# EAGLE design ballanced_detector (EAGLE 9.6.2)
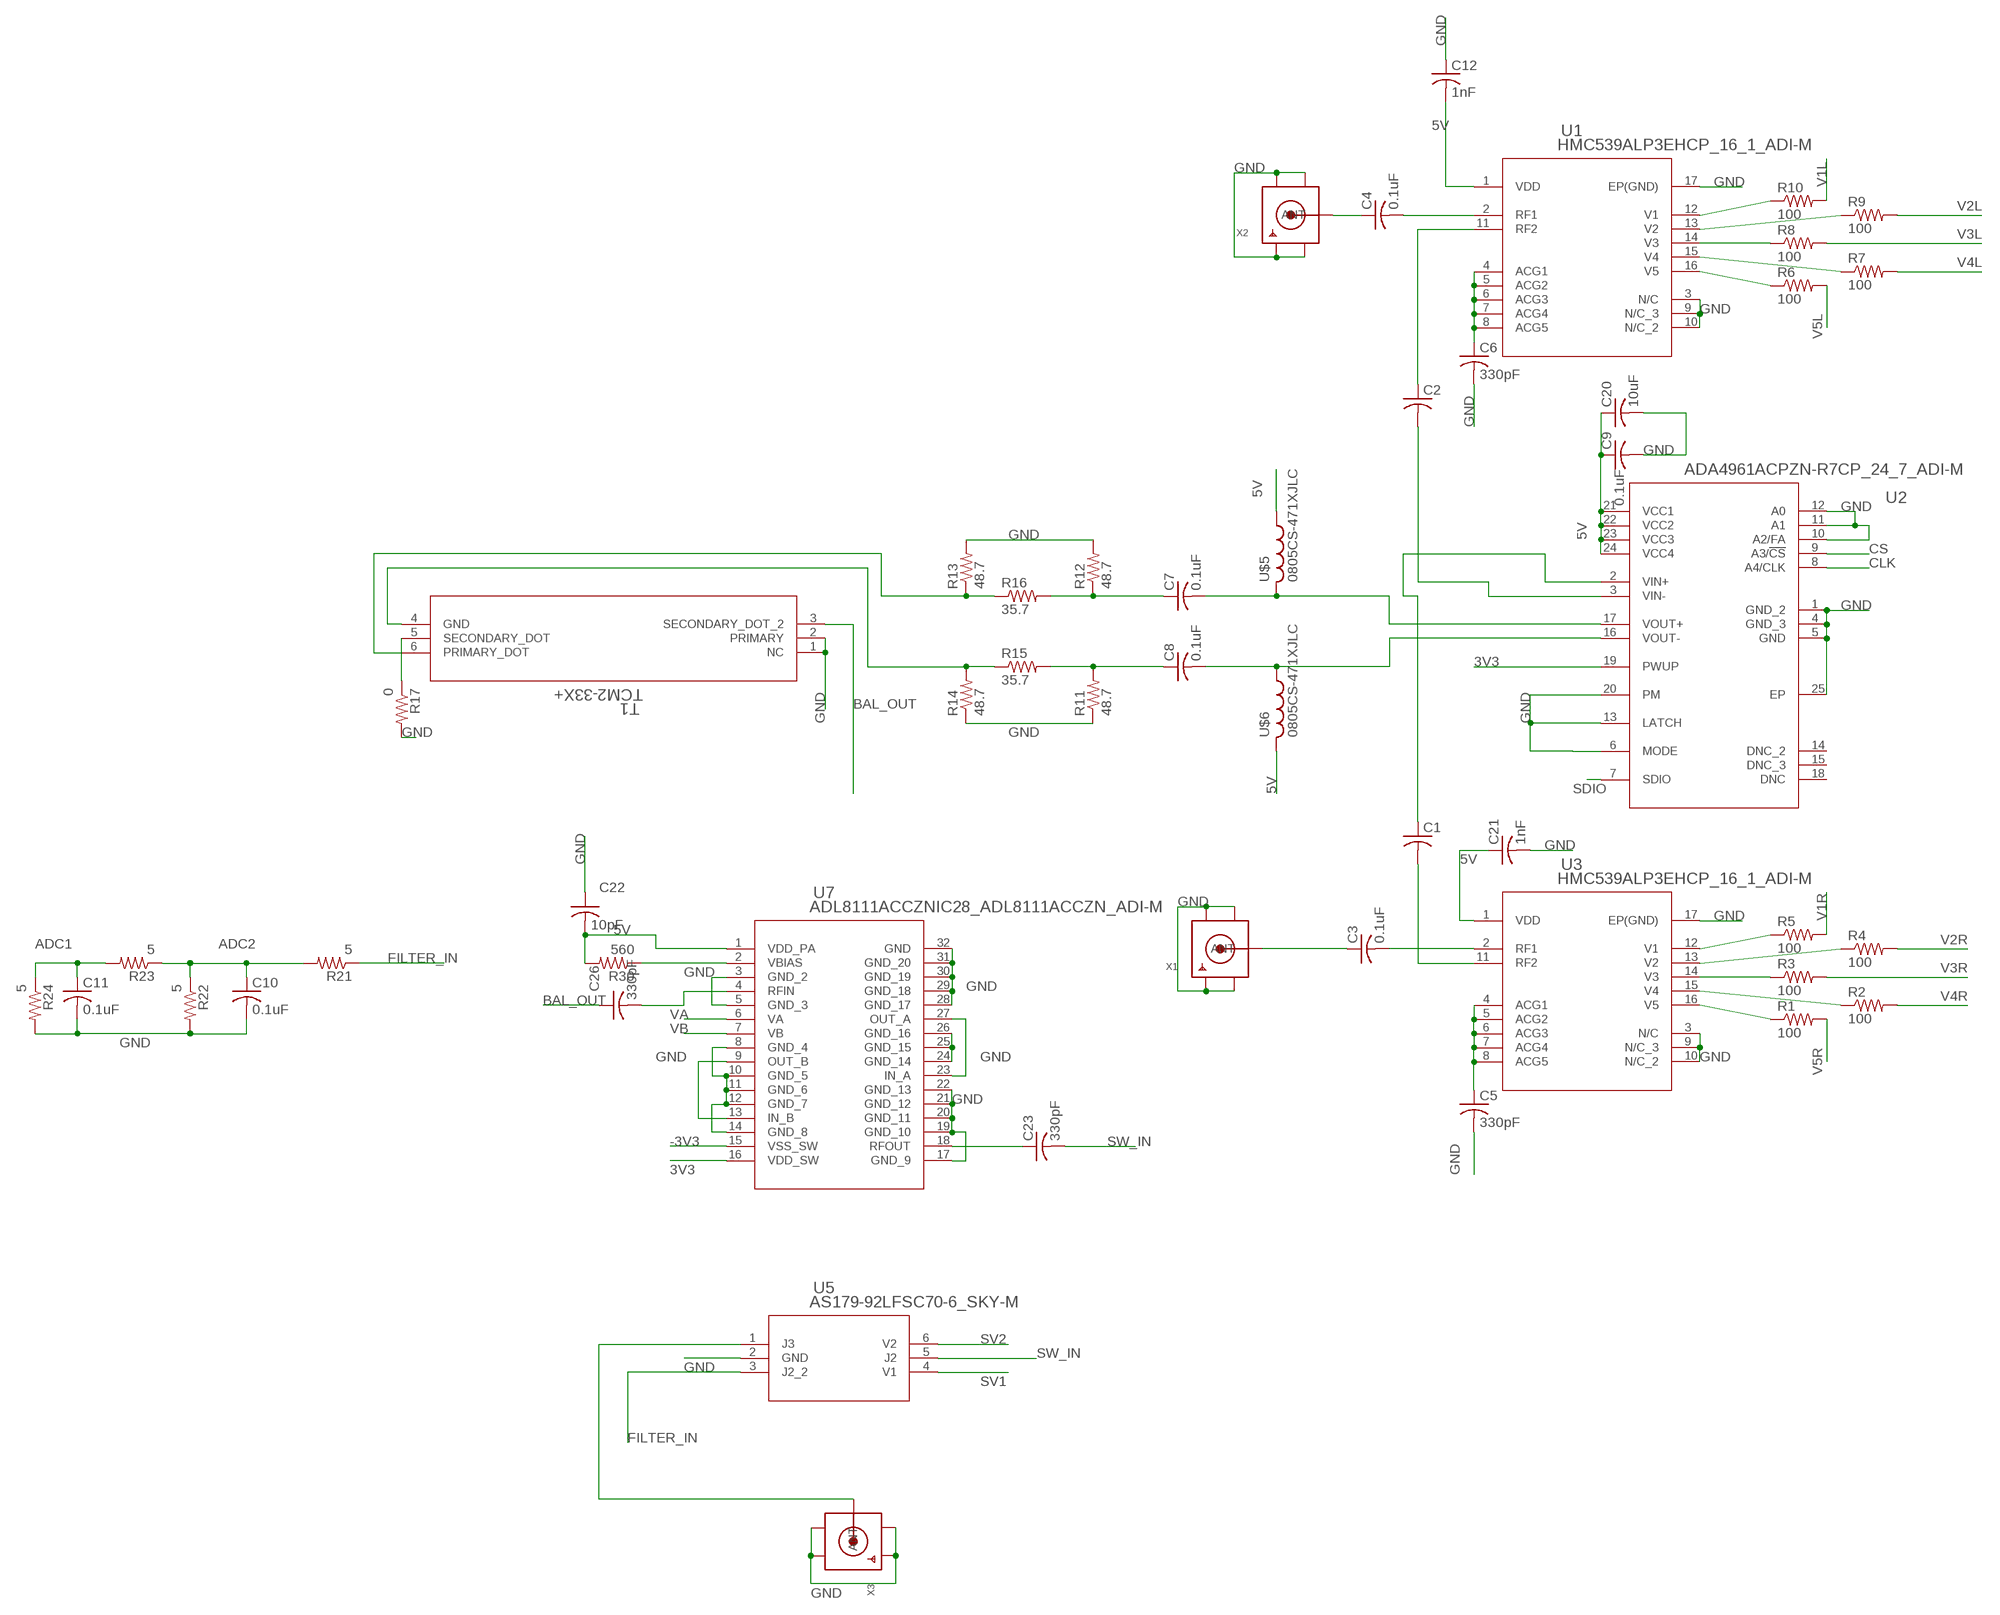
[diagram p0: schematic, sheet 1, part 1 of 2]
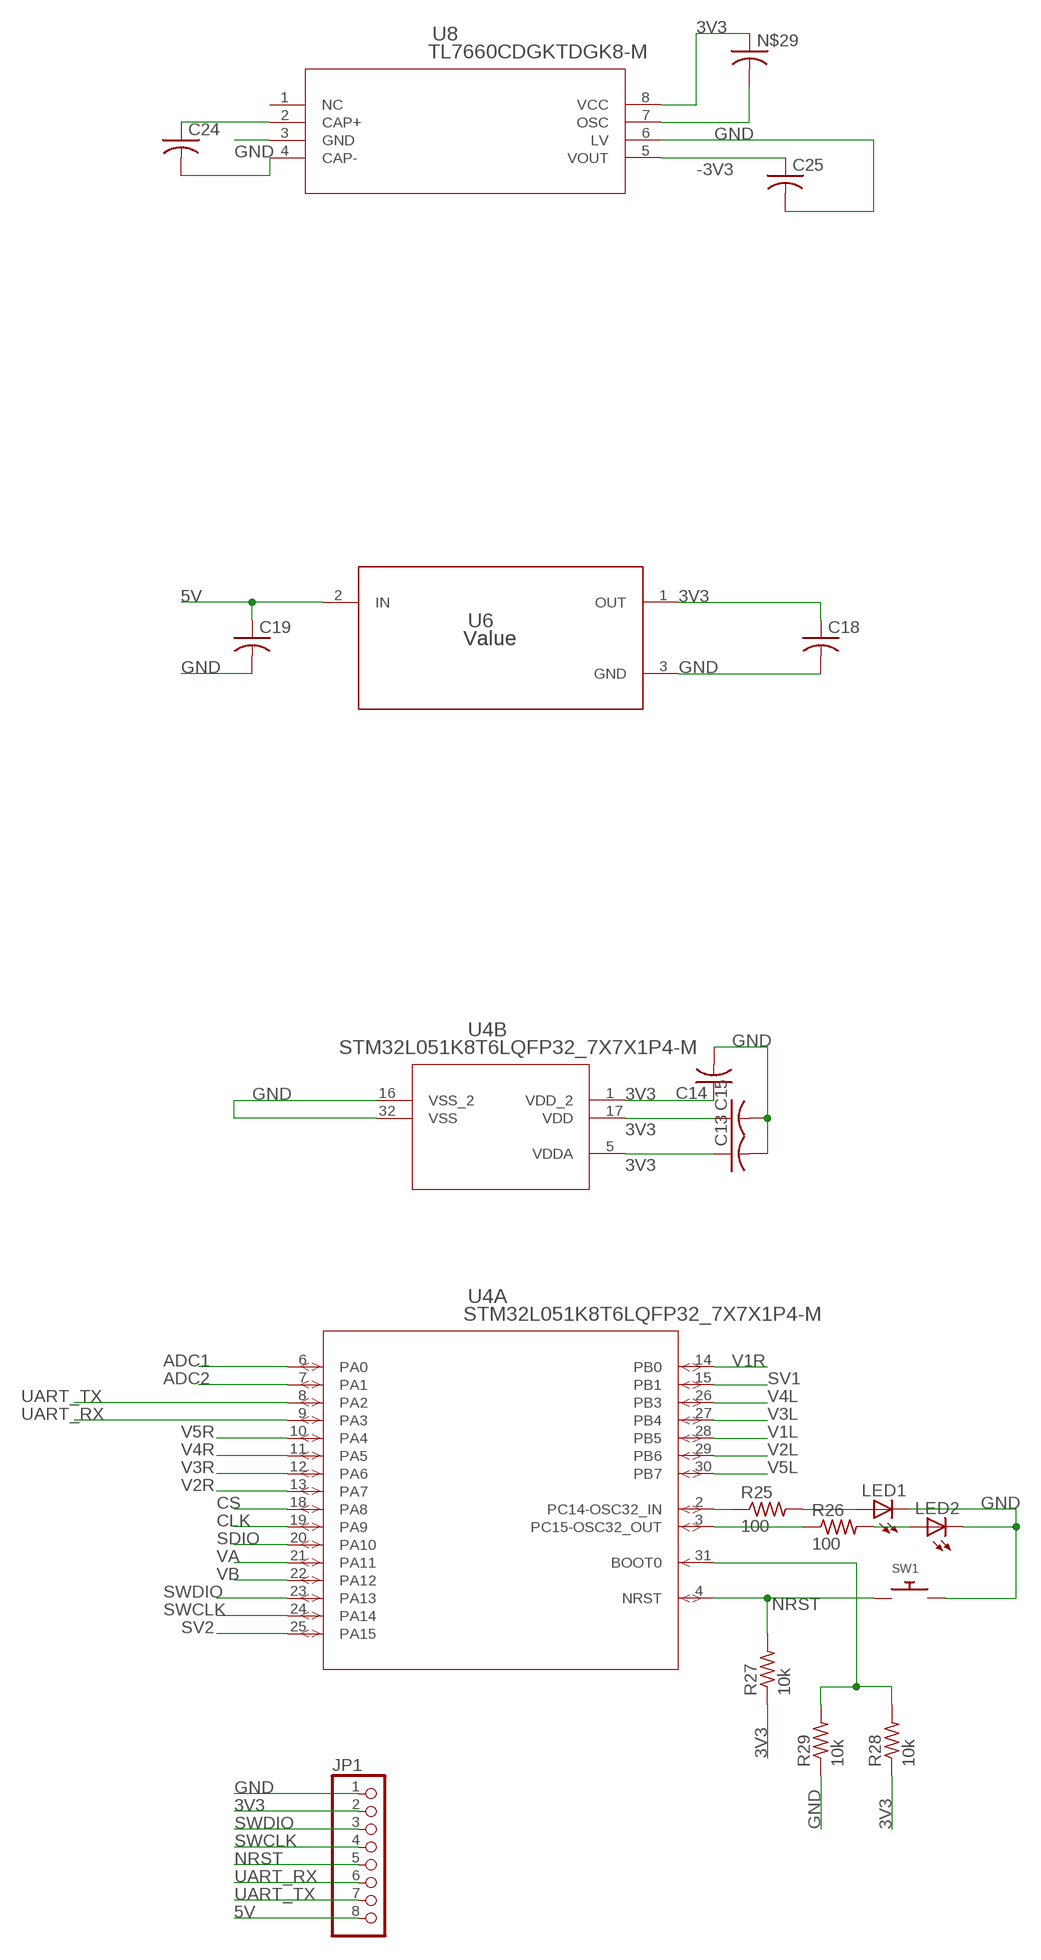
[diagram p1: schematic, sheet 1, part 2 of 2]

## Parts
C1  C-USC0402  [C0402]
C2  C-USC0402  [C0402]
C3  0.1uF  C-USC0402  [C0402]
C4  0.1uF  C-USC0402  [C0402]
C5  330pF  C-USC0402  [C0402]
C6  330pF  C-USC0402  [C0402]
C7  0.1uF  C-USC0402  [C0402]
C8  0.1uF  C-USC0402  [C0402]
C9  0.1uF  C-USC0402  [C0402]
C10  0.1uF  C-USC0402  [C0402]
C11  0.1uF  C-USC0402  [C0402]
C12  1nF  C-USC0402  [C0402]
C13  C-USC0402  [C0402]
C14  C-USC0402  [C0402]
C15  C-USC0402  [C0402]
C18  C-USC0402  [C0402]
C19  C-USC0402  [C0402]
C20  10uF  C-USC0402  [C0402]
C21  1nF  C-USC0402  [C0402]
C22  10pF  C-USC0402  [C0402]
C23  330pF  C-USC0402  [C0402]
C24  C-USC1210  [C1210]
C25  C-USC1210  [C1210]
C26  330pF  C-USC0402  [C0402]
JP1  PINHD-1X8CLEANBIG  [1X08-CLEANBIG]
LED1  LEDCHIP-LED0805  [CHIP-LED0805]
LED2  LEDCHIP-LED0805  [CHIP-LED0805]
N$29  C-USC1210  [C1210]
R1  100  R-US_R0402  [R0402]
R2  100  R-US_R0402  [R0402]
R3  100  R-US_R0402  [R0402]
R4  100  R-US_R0402  [R0402]
R5  100  R-US_R0402  [R0402]
R6  100  R-US_R0402  [R0402]
R7  100  R-US_R0402  [R0402]
R8  100  R-US_R0402  [R0402]
R9  100  R-US_R0402  [R0402]
R10  100  R-US_R0402  [R0402]
R11  48.7  R-US_R0402  [R0402]
R12  48.7  R-US_R0402  [R0402]
R13  48.7  R-US_R0402  [R0402]
R14  48.7  R-US_R0402  [R0402]
R15  35.7  R-US_R0402  [R0402]
R16  35.7  R-US_R0402  [R0402]
R17  0  R-US_R0402  [R0402]
R21  5  R-US_R0402  [R0402]
R22  5  R-US_R0402  [R0402]
R23  5  R-US_R0402  [R0402]
R24  5  R-US_R0402  [R0402]
R25  100  R-US_R0402  [R0402]
R26  100  R-US_R0402  [R0402]
R27  10k  R-US_R0402  [R0402]
R28  10k  R-US_R0402  [R0402]
R29  10k  R-US_R0402  [R0402]
R30  560  R-US_R0402  [R0402]
SW1  SWITCH_PUSHBUTTONC&K_KSS  [BTN_CK_KSS]
T1  TCM2-33X+  [DB1627_MNC]
U1  HMC539ALP3EHCP_16_1_ADI-M  [HCP_16_1_ADI-M]
U2  ADA4961ACPZN-R7CP_24_7_ADI-M  [CP_24_7_ADI-M]
U3  HMC539ALP3EHCP_16_1_ADI-M  [HCP_16_1_ADI-M]
U4  STM32L051K8T6LQFP32_7X7X1P4-M  [LQFP32_7X7X1P4-M]
U5  AS179-92LFSC70-6_SKY-M  [SC70-6_SKY-M]
U6  Value  LM3480IM3-3.3  [DBZ0003A_N]
U7  ADL8111ACCZNIC28_ADL8111ACCZN_ADI-M  [IC28_ADL8111ACCZN_ADI-M]
U8  TL7660CDGKTDGK8-M  [DGK8-M]
U$5  0805CS-471XJLC  [R0805]
U$6  0805CS-471XJLC  [R0805]
X1  SMACONNECTOR_EDGE  [SMA_EDGELAUNCH]
X2  SMACONNECTOR_EDGE  [SMA_EDGELAUNCH]
X3  SMACONNECTOR_EDGE  [SMA_EDGELAUNCH]

## Nets
3V3: C13.1 C14.1 C15.1 C18.1 JP1.2 N$29.1 R27.1 R28.1 U2.19(PWUP) U4.1(B:VDD_2) U4.5(B:VDDA) U4.17(B:VDD) U6.1(OUT) U7.16(VDD_SW) U8.8(VCC)
5V: C9.1 C12.2 C19.1 C20.1 C21.1 C22.2 JP1.8 R30.2 U1.1(VDD) U2.21(VCC1) U2.22(VCC2) U2.23(VCC3) U2.24(VCC4) U3.1(VDD) U6.2(IN) U7.1(VDD_PA) U$5.1 U$6.2
-3V3: C25.1 U7.15(VSS_SW) U8.5(VOUT)
ADC1: C11.1 R23.2 R24.1 U4.6(A:PA0)
ADC2: C10.1 R21.2 R22.1 R23.1 U4.7(A:PA1)
BAL_OUT: C26.1 T1.3(SECONDARY_DOT_2)
CLK: U2.8(A4/CLK) U4.19(A:PA9)
CS: U2.9(A3/!CS) U4.18(A:PA8)
FILTER_IN: R21.1 U5.3(J2_2)
GND: C5.2 C6.2 C9.2 C10.2 C11.2 C12.1 C13.2 C14.2 C15.2 C18.2 C19.2 C20.2 C21.2 C22.1 C25.2 JP1.1 LED1.C LED2.C R11.1 R12.2 R13.2 R14.1 R17.2 R22.2 R24.2 R29.1 SW1.P$2 T1.1(NC) T1.2(PRIMARY) U1.3(N/C) U1.9(N/C_3) U1.10(N/C_2) U1.17(EP(GND)) U2.1(GND_2) U2.4(GND_3) U2.5(GND) U2.6(MODE) U2.10(A2/FA) U2.11(A1) U2.12(A0) U2.13(LATCH) U2.20(PM) U2.25(EP) U3.3(N/C) U3.9(N/C_3) U3.10(N/C_2) U3.17(EP(GND)) U4.16(B:VSS_2) U4.32(B:VSS) U5.2(GND) U6.3(GND) U7.3(GND_2) U7.5(GND_3) U7.8(GND_4) U7.10(GND_5) U7.11(GND_6) U7.12(GND_7) U7.14(GND_8) U7.17(GND_9) U7.19(GND_10) U7.20(GND_11) U7.21(GND_12) U7.22(GND_13) U7.24(GND_14) U7.25(GND_15) U7.26(GND_16) U7.28(GND_17) U7.29(GND_18) U7.30(GND_19) U7.31(GND_20) U7.32(GND) U8.3(GND) U8.6(LV) X1.GND@1(GND4) X1.GND@2(GND3) X1.GND@3(GND2) X1.GND@4(GND1) X2.GND@1(GND4) X2.GND@2(GND3) X2.GND@3(GND2) X2.GND@4(GND1) X3.GND@1(GND4) X3.GND@2(GND3) X3.GND@3(GND2) X3.GND@4(GND1)
N$1: C1.2 U3.11(RF2)
N$2: C1.1 U2.2(VIN+)
N$3: C2.2 U2.3(VIN-)
N$4: C2.1 U1.11(RF2)
N$5: C3.2 U3.2(RF1)
N$6: C4.1 X2.P(ANT)
N$7: C4.2 U1.2(RF1)
N$8: C3.1 X1.P(ANT)
N$9: C7.2 U2.17(VOUT+) U$5.2
N$10: C8.2 U2.16(VOUT-) U$6.1
N$11: C8.1 R11.2 R15.2
N$12: C5.1 U3.4(ACG1) U3.5(ACG2) U3.6(ACG3) U3.7(ACG4) U3.8(ACG5)
N$13: C6.1 U1.4(ACG1) U1.5(ACG2) U1.6(ACG3) U1.7(ACG4) U1.8(ACG5)
N$14: R10.1 U1.12(V1)
N$15: R9.1 U1.13(V2)
N$16: R8.1 U1.14(V3)
N$17: R7.1 U1.15(V4)
N$18: R6.1 U1.16(V5)
N$19: R5.1 U3.12(V1)
N$20: R4.1 U3.13(V2)
N$21: R3.1 U3.14(V3)
N$22: R2.1 U3.15(V4)
N$23: R1.1 U3.16(V5)
N$24: C7.1 R12.1 R16.2
N$25: R14.2 R15.1 T1.4(GND)
N$26: R13.1 R16.1 T1.6(PRIMARY_DOT)
N$27: C26.2 U7.4(RFIN)
N$28: C23.1 U7.18(RFOUT)
N$29: N$29.2 U8.7(OSC)
N$31: C24.1 U8.2(CAP+)
N$32: U5.1(J3) X3.P(ANT)
N$33: R25.1 U4.2(A:PC14-OSC32_IN)
N$34: R26.1 U4.3(A:PC15-OSC32_OUT)
N$35: LED1.A R25.2
N$36: LED2.A R26.2
N$37: C24.2 U8.4(CAP-)
N$38: R28.2 R29.2 U4.31(A:BOOT0)
N$39: R17.1 T1.5(SECONDARY_DOT)
N$44: U7.23(IN_A) U7.27(OUT_A)
N$45: U7.9(OUT_B) U7.13(IN_B)
N$46: R30.1 U7.2(VBIAS)
NRST: JP1.5 R27.2 SW1.P$1 U4.4(A:NRST)
SDIO: U2.7(SDIO) U4.20(A:PA10)
SV1: U4.15(A:PB1) U5.4(V1)
SV2: U4.25(A:PA15) U5.6(V2)
SW_IN: C23.2 U5.5(J2)
SWCLK: JP1.4 U4.24(A:PA14)
SWDIO: JP1.3 U4.23(A:PA13)
UART_RX: JP1.6 U4.9(A:PA3)
UART_TX: JP1.7 U4.8(A:PA2)
V1L: R10.2 U4.28(A:PB5)
V1R: R5.2 U4.14(A:PB0)
V2L: R9.2 U4.29(A:PB6)
V2R: R4.2 U4.13(A:PA7)
V3L: R8.2 U4.27(A:PB4)
V3R: R3.2 U4.12(A:PA6)
V4L: R7.2 U4.26(A:PB3)
V4R: R2.2 U4.11(A:PA5)
V5L: R6.2 U4.30(A:PB7)
V5R: R1.2 U4.10(A:PA4)
VA: U4.21(A:PA11) U7.6(VA)
VB: U4.22(A:PA12) U7.7(VB)
Unconnected: U2.14(DNC_2) U2.15(DNC_3) U2.18(DNC) U8.1(NC)

## Library data of the parts
C1-C15 C18-C26 N$29 = adafruit:C-US: CAPACITOR, American symbol
JP1 = adafruit:PINHD-1X8: PIN HEADER
LED1 LED2 = adafruit:LED: LED OSRAM: - CHIPLED LG R971, LG N971, LY N971, LG Q971, LY Q971, LO R971, LY R971 LH N974, LH R974 LS Q976, LO Q976, LY Q976 LO Q996 - Hyper CHIPLED LW Q18S LB Q993, LB Q99A, LB R99A - SideLED LS A670, LO A670, LY A670, LG A670, LP A670 LB A673, LV A673, LT A673, LW A673 LH A674 LY A675 LS A676, LA A676, LO A676, LY A676, LW A676 LS A679, LY A679, LG A679 - Hyper Micro SIDELED® LS Y876, LA Y876, LO Y876, LY Y876 LT Y87S - SmartLED LW L88C, LW L88S LB L89C, LB L89S, LG L890 LS L89K, LO L89K, LY L89K LS L896, LA L896, LO L896, LY L896 - TOPLED LS T670, LO T670, LY T670, LG T670, LP T670 LSG T670, LSP T670, LSY T670, LOP T670, LYG T670 LG T671, LOG T671, LSG T671 LB T673, LV T673, LT T673, LW T673 LH T674 LS T676, LA T676, LO T676, LY T676, LB T676, LH T676, LSB T676, LW T676 LB T67C, LV T67C, LT T67C, LS T67K, LO T67K, LY T67K, LW E67C LS E67B, LA E67B, LO E67B, LY E67B, LB E67C, LV E67C, LT E67C LW T67C LS T679, LY T679, LG T679 LS T770, LO T770, LY T770, LG T770, LP T770 LB T773, LV T773, LT T773, LW T773 LH T774 LS E675, LA E675, LY E675, LS T675 LS T776, LA T776, LO T776, LY T776, LB T776 LHGB T686 LT T68C, LB T68C - Hyper Mini TOPLED® LB M676 - Mini TOPLED Santana® LG M470 LS M47K, LO M47K, LY M47K Source: http://www.osram.convergy.de/
R1-R17 R21-R30 = adafruit:R-US_: RESISTOR, American symbol
SW1 = adafruit:SWITCH_PUSHBUTTON: Buttons SOFTTOUCHSMD_SJ - Soft touch temporary push button (Super Junk Akihabara) Compatible with SKPMANE010 [Mouser: 688-SKPMAN] C&K_KSS = Digikey: KSS221GLFS
T1 = balun:TCM2-33X+; BUILT_BY: EMA_Cory; COPYRIGHT: Copyright (C) 2018 Accelerated Designs. All rights reserved; DATASHEET: https://www.minicircuits.com/pdfs/TCM2-33X+.pdf; MANUFACTURER_PART_NUMBER: TCM2-33X+; SOURCELIBRARY: Mini_Circuits_2020-05-22; VENDOR: Mini Circuits
U1 U3 = attenuator:HMC539ALP3E; BUILT_BY: Analog Devices Inc.; MANUFACTURER_PART_NUMBER: HMC539ALP3E; SOURCELIBRARY: Analog_2018-03-03; VENDOR: Analog Devices Inc
U2 = amplifier:ADA4961ACPZN-R7; BUILT_BY: EMA_UL_Team; MANUFACTURER_PART_NUMBER: ADA4961ACPZN-R7; SOURCELIBRARY: Analog_2015-12-15; VENDOR: Analog Devices Inc
U4 = micro:STM32L051K8T6; BUILT_BY: EMA_UL_Team; COPYRIGHT: Copyright (C) 2018 Accelerated Designs. All rights reserved; MANUFACTURER_PART_NUMBER: STM32L051K8T6; SOURCELIBRARY: Updates_to_database_2020-10-19; VENDOR: STMicroelectronics
U5 = rf_switch:AS179-92LF; BUILT_BY: EMA_Jessica; COPYRIGHT: Copyright (C) 2016 Accelerated Designs. All rights reserved; MANUFACTURER_PART_NUMBER: AS179-92LF; SOURCELIBRARY: Skyworks_2018-12-15; VENDOR: Skyworks
U6 = passives:LM3480IM3-3.3; MANUFACTURER: Texas Instruments; PARTNUMBER: LM3480IM3X-3.3/NOPB; REFDES: RefDes; TYPE: TYPE
U7 = passives:ADL8111ACCZN; BUILT_BY: EMA_Kyle; COPYRIGHT: Copyright (C) 2018 Accelerated Designs. All rights reserved; DATASHEET: https://www.analog.com/media/en/technical-documentation/data-sheets/ADL8111.pdf; MANUFACTURER_PART_NUMBER: ADL8111ACCZN; SOURCELIBRARY: Analog_Devices_Inc_2020-07-27; VENDOR: Analog Devices Inc
U8 = amplifier:TL7660CDGKT; DATASHEET_URL: http://www.ti.com/lit/gpn/TL7660; DESCRIPTION: CMOS Voltage Converter; FAMILY_NAME: LOW POWER; GENERIC_PART_NUMBER: TL7660; INDUSTRY_STD_PKG_TYPE: MSOP; MANUFACTURER: Texas Instruments; MANUFACTURER_PART_NUMBER: TL7660CDGKT; PACKAGE_DESIGNATOR: DGK; PIN_COUNT: 8; VENDOR: Texas Instruments
U$5 U$6 = passives:0805CS-471XJLC
X1-X3 = adafruit:SMACONNECTOR: SMA Connector 90° DIP SMA Connector, 50 Ohm (4UConnector: 07259)

## Board
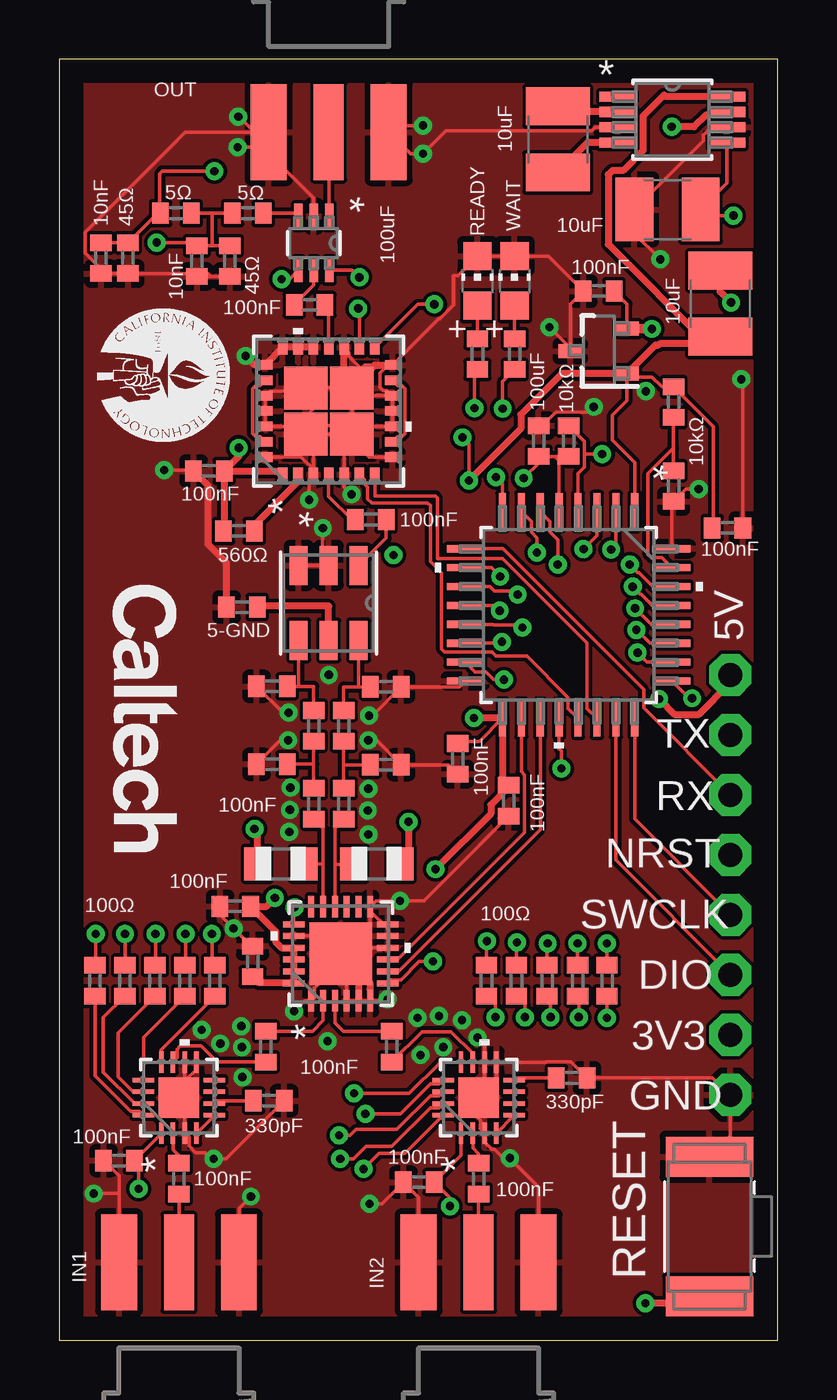
[diagram p2: board, top side]
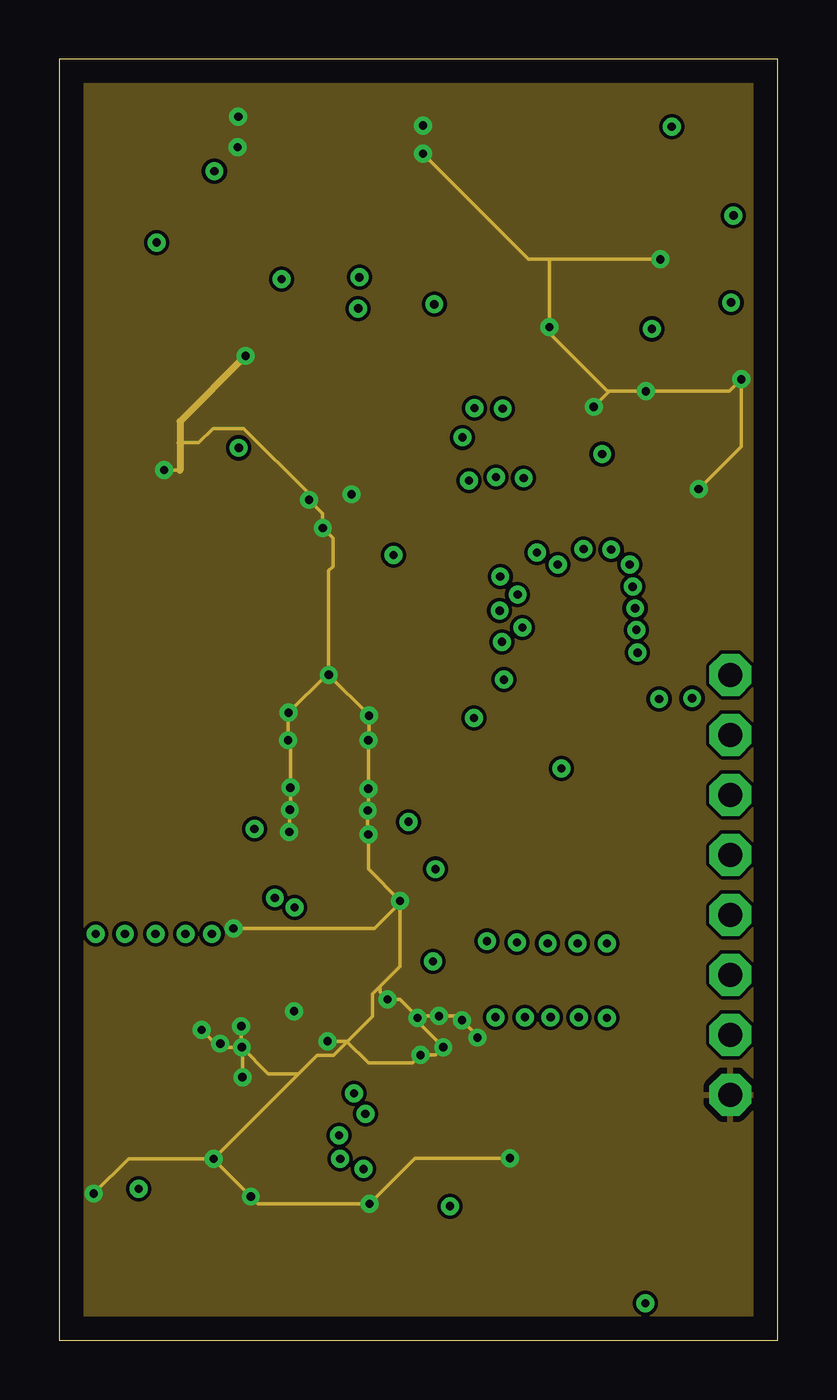
[diagram p3: board, inner layer Route2]
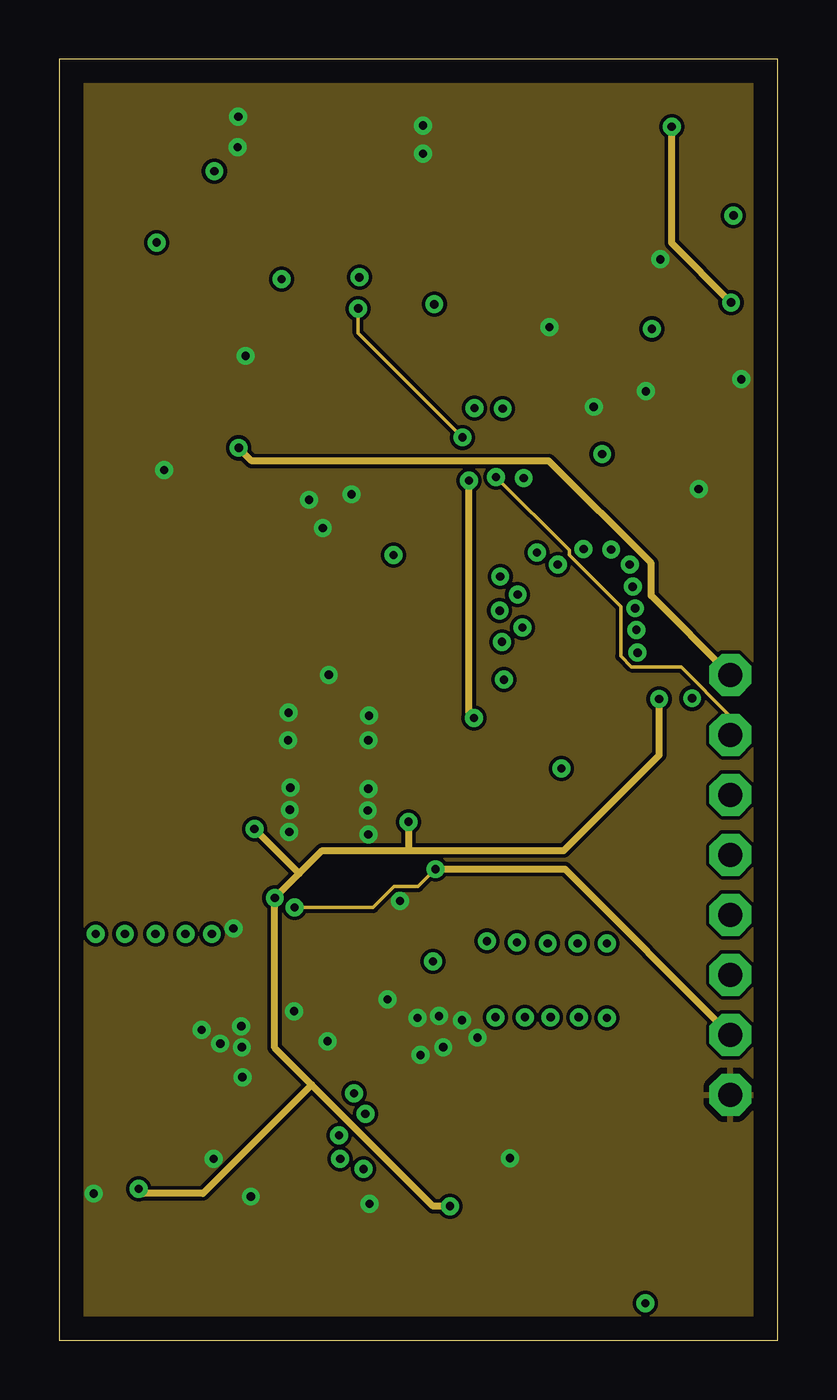
[diagram p4: board, inner layer Route15]
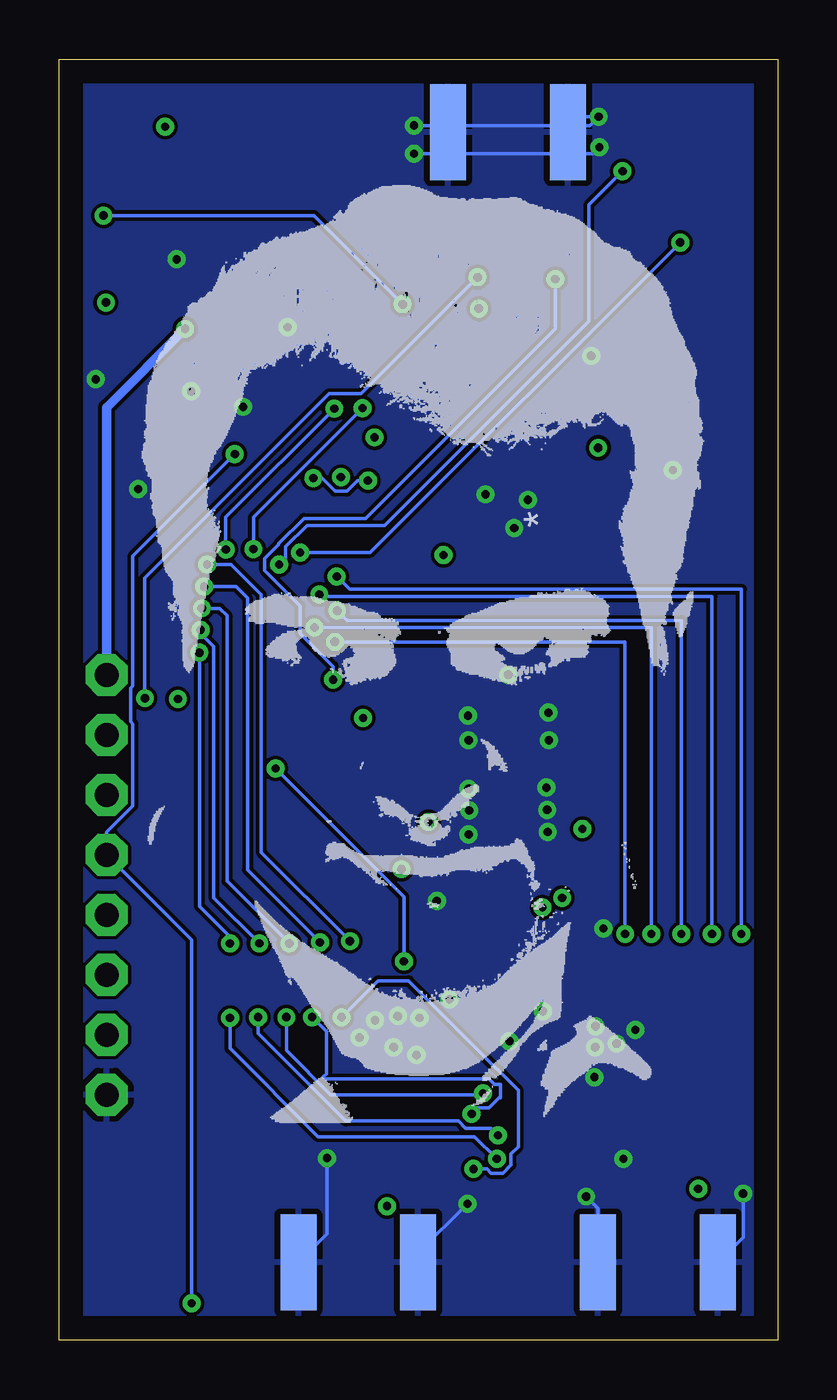
[diagram p5: board, bottom side, seen from below]

Size 30.46 x 54.28 mm. Coordinates in mm from the lower left corner, seen from the top.
Outline: 0,0 30.46,0 30.46,54.28 0,54.28 0,0
Copper layers (1+2*15+16): Top 0.035mm / dielectric 1.5mm / Route2 0.035mm / dielectric 0.15mm / Route15 0.035mm / dielectric 0.2mm / Bottom 0.035mm
Design rules "default *": minimum track width 6mil, minimum drill 0.35mm, track to track 6mil, track to pad 6mil, pad to pad 6mil, via to via 6mil, smd to smd 6mil, copper to edge 40mil, drill to drill 6mil, minimum pad ring 10mil, minimum via ring 8mil, stop-mask expansion 4mil, vias tented up to drill 0mil, thermal gap 10mil

### Footprints (pad centres in the part's own frame; a part is rotated, then mirrored left to right if it is on the bottom)
C0402 = smd 0.7 x 0.9: 1 -0.65,0; 2 0.65,0
C1210 = smd 1.6 x 2.7: 1 -1.4,0; 2 1.4,0
1X08-CLEANBIG = drill 1.016 pad 1.778 octagon: 1 -8.89,0; 2 -6.35,0; 3 -3.81,0; 4 -1.27,0; 5 1.27,0; 6 3.81,0; 7 6.35,0; 8 8.89,0
CHIP-LED0805 = smd 1.2 x 1.2: A 0,-1.05; C 0,1.05
R0402 = smd 0.7 x 0.9: 1 -0.65,0; 2 0.65,0
BTN_CK_KSS = smd 1.7 x 3.7: P$1 -2.95,0; P$2 2.95,0
DB1627_MNC = smd 1.651 x 0.762: 1 -1.587,-1.27; 2 -1.587,0; 3 -1.587,1.27; 4 1.587,1.27; 5 1.587,0; 6 1.587,-1.27
HCP_16_1_ADI-M = smd 0.906 x 0.189: 1 -1.503,0.75; 2 -1.503,0.25; 3 -1.503,-0.25; 4 -1.503,-0.75; 9 1.503,-0.75; 10 1.503,-0.25; 11 1.503,0.25; 12 1.503,0.75 | smd 0.189 x 0.906: 5 -0.75,-1.503; 6 -0.25,-1.503; 7 0.25,-1.503; 8 0.75,-1.503; 13 0.75,1.503; 14 0.25,1.503; 15 -0.25,1.503; 16 -0.75,1.503 | smd 1.725 x 1.725: 17 0,0
CP_24_7_ADI-M = smd 0.914 x 0.254: 1 -1.994,1.25; 2 -1.994,0.75; 3 -1.994,0.25; 4 -1.994,-0.25; 5 -1.994,-0.75; 6 -1.994,-1.25; 13 1.994,-1.25; 14 1.994,-0.75; 15 1.994,-0.25; 16 1.994,0.25; 17 1.994,0.75; 18 1.994,1.25 | smd 0.254 x 0.914: 7 -1.25,-1.994; 8 -0.75,-1.994; 9 -0.25,-1.994; 10 0.25,-1.994; 11 0.75,-1.994; 12 1.25,-1.994; 19 1.25,1.994; 20 0.75,1.994; 21 0.25,1.994; 22 -0.25,1.994; 23 -0.75,1.994; 24 -1.25,1.994 | smd 2.642 x 2.642: 25 0,0
LQFP32_7X7X1P4-M = smd 1.562 x 0.305: 1 -4.375,2.8; 2 -4.375,2; 3 -4.375,1.2; 4 -4.375,0.4; 5 -4.375,-0.4; 6 -4.375,-1.2; 7 -4.375,-2; 8 -4.375,-2.8; 17 4.375,-2.8; 18 4.375,-2; 19 4.375,-1.2; 20 4.375,-0.4; 21 4.375,0.4; 22 4.375,1.2; 23 4.375,2; 24 4.375,2.8 | smd 0.305 x 1.562: 9 -2.8,-4.375; 10 -2,-4.375; 11 -1.2,-4.375; 12 -0.4,-4.375; 13 0.4,-4.375; 14 1.2,-4.375; 15 2,-4.375; 16 2.8,-4.375; 25 2.8,4.375; 26 2,4.375; 27 1.2,4.375; 28 0.4,4.375; 29 -0.4,4.375; 30 -1.2,4.375; 31 -2,4.375; 32 -2.8,4.375
SC70-6_SKY-M = smd 1.041 x 0.356: 1 -1.143,0.65; 2 -1.143,0; 3 -1.143,-0.65; 4 1.143,-0.65; 5 1.143,0; 6 1.143,0.65
DBZ0003A_N = smd 1 x 0.6: 1 -1.2,0.95; 2 -1.2,-0.95; 3 1.2,0
IC28_ADL8111ACCZN_ADI-M = smd 0.61 x 0.406: 1 -2.696,1.95; 2 -2.696,1.3; 3 -2.696,0.65; 4 -2.696,0; 5 -2.696,-0.65; 6 -2.696,-1.3; 7 -2.696,-1.95; 15 2.696,-1.95; 16 2.696,-1.3; 17 2.696,-0.65; 18 2.696,0; 19 2.696,0.65; 20 2.696,1.3; 21 2.696,1.95 | smd 0.406 x 0.61: 8 -1.95,-2.696; 9 -1.3,-2.696; 10 -0.65,-2.696; 11 0,-2.696; 12 0.65,-2.696; 13 1.3,-2.696; 14 1.95,-2.696; 22 1.95,2.696; 23 1.3,2.696; 24 0.65,2.696; 25 0,2.696; 26 -0.65,2.696; 27 -1.3,2.696; 28 -1.95,2.696 | smd 1.829 x 1.829: 29 -0.975,-0.975; 30 -0.975,0.975; 31 0.975,-0.975; 32 0.975,0.975
DGK8-M = smd 1.537 x 0.432: 1 -2.318,0.975; 2 -2.318,0.325; 3 -2.318,-0.325; 4 -2.318,-0.975; 5 2.318,-0.975; 6 2.318,-0.325; 7 2.318,0.325; 8 2.318,0.975
R0805 = smd 1.1 x 1.4: 1 -1,0; 2 1,0
SMA_EDGELAUNCH = smd 4.064 x 1.524: GND@1 2.032,-2.54; GND@2 2.032,2.54 | smd 4.064 x 1.524 bottom: GND@3 2.032,2.54; GND@4 2.032,-2.54 | smd 4.064 x 1.27: P 2.032,0

### Placement (x,y rotation side)
C1  8.76,12.45 270 top
C2  14.1,12.45 90 top
C3  5.08,6.86 90 top
C4  17.78,6.86 90 top
C5  8.89,10.16 0 top
C6  21.72,11.13 0 top
C7  10.79,22.73 270 top
C8  12.06,22.73 270 top
C9  7.47,18.39 180 top
C10  7.24,45.72 270 top
C11  1.78,45.85 270 top
C12  2.54,7.62 0 top
C13  16.89,24.64 270 top
C14  28.32,34.42 0 top
C15  19.05,22.86 270 top
C18  20.32,38.1 90 top
C19  22.86,44.45 180 top
C20  8.2,16.05 90 top
C21  15.24,6.71 180 top
C22  6.35,36.83 0 top
C23  10.62,43.87 180 top
C24  21.13,50.88 270 top
C25  25.78,47.9 180 top
C26  13.21,34.77 180 top
JP1  28.45,19.3 90 top
LED1  19.3,44.88 0 top
LED2  17.73,44.88 0 top
N$29  28.02,43.92 90 top
R1  1.52,15.24 90 top
R2  2.79,15.24 90 top
R3  4.06,15.24 90 top
R4  5.33,15.24 90 top
R5  6.6,15.24 90 top
R6  18.11,15.24 90 top
R7  23.22,15.24 90 top
R8  21.97,15.24 90 top
R9  19.38,15.24 90 top
R10  20.68,15.24 90 top
R11  13.84,24.38 180 top
R12  9.02,24.41 180 top
R13  9.02,27.71 180 top
R14  13.84,27.69 180 top
R15  12.06,26.04 270 top
R16  10.79,26.04 270 top
R17  7.75,31.06 180 top
R21  8,47.75 180 top
R22  5.84,45.72 270 top
R23  4.95,47.75 180 top
R24  2.92,45.85 270 top
R25  19.3,41.78 90 top
R26  17.73,41.78 90 top
R27  21.59,38.1 90 top
R28  26.04,39.75 270 top
R29  26.04,36.2 90 top
R30  7.62,34.29 180 top
SW1  27.56,4.83 90 top
T1  11.43,31.24 270 top
U1  17.78,10.29 90 top
U2  11.94,16.38 90 top
U3  5.08,10.29 90 top
U4  21.59,30.73 270 top
U5  10.79,46.48 270 top
U6  22.86,41.91 180 top
U7  11.43,39.37 90 top
U8  25.98,51.71 0 top
U$5  9.4,20.19 0 top
U$6  13.46,20.19 0 top
X1  5.08,1.27 90 top
X2  17.78,1.27 90 top
X3  11.43,53.21 270 top

### Tracks (layer width: path | path; a pad name or v marks a point on that pad's centre or on a via)
3V3  (via drill 0.35)
  Top 0.152: U7.16 12.73,42.88 12.73,43.66 v12.68,43.71 | C18.1 20.4,37.45 | R27.1 21.01,37.45 | 21.01,37.45 21.19,37.27 U4.5 | U4.1 24.39,37.19 23.45,38.13 23.45,39.2 24.06,39.8 U6.1 24.2,40.81 25.12,40.81 25.53,40.4 R28.1 27.72,38.71 27.72,34.47 C14.1 | C13.1 16.89,25.38 17.81,25.38 U4.17 | U2.19 9.94,18.3 v9.98,18.34 | v17.09,38.25 17.37,37.97 v17.37,36.42 | v19.68,36.52 20.4,37.24 20.4,37.45 | 27.46,42.25 27.73,42.52 N$29.1 27.71,42.22 27.46,42.22 | 21.01,37.45 20.4,37.45
  Top 0.305: v17.37,36.42 19.57,38.62 19.57,39.23 21.3,40.96 U6.1 25.27,42.17 25.4,42.17 25.45,42.22 27.46,42.22 | 27.46,42.25 23.28,46.43 23.28,49.38 23.45,49.56 23.9,49.56 24.74,50.4 24.74,51.87 25.63,52.76 25.7,52.69 U8.8 | v15.95,19.96 18.3,22.31 18.3,22.69 19.05,23.44 C15.1 18.79,23.77 U4.17 v17.58,26.36
  Route15 0.152: v9.98,18.34 13.31,18.34 14.2,19.23 15.21,19.23 v15.95,19.96 | v17.09,38.25 12.68,42.67 v12.68,43.71
  Route15 0.305: v17.37,36.42 17.37,26.57 v17.58,26.36 | v15.95,19.96 21.44,19.96 JP1.2
  Bottom 0.152: v19.68,36.52 19.32,36.52 18.77,35.97 18.27,35.97 17.81,36.42 v17.37,36.42
5V  (via drill 0.35)
  Top 0.152: C22.2 7.16,36.83 | 7.16,36.83 9.32,36.83 | 9.44,36.72 U7.1 | R30.2 6.97,34.52 6.97,36.64 7.16,36.83 | C12.2 3.22,7.65 | 3.22,7.65 4.33,8.76 U3.1 | U2.24 9.94,15.15 | U6.2 24.06,43.9 C19.1 | U1.1 17.03,7.85 C21.1 16.56,6.04 v16.56,5.69 | v3.38,6.43 3.38,7.49 3.22,7.65
  Top 0.305: C22.2 9.32,36.83 9.44,36.72 | C22.2 7,34.55 6.97,34.52 | C20.1 8.46,15.15 9.94,15.15 | v9.14,18.75 8.79,18.39 C9.1 9.18,17.32 9.18,16.88 9.43,16.63 U2.21 U2.22 U2.23 U2.24 | v25.43,27.17 26.08,26.52 27.11,26.52 28.45,27.86 JP1.8 | C22.2 7.62,37.45 v7.62,37.81 | v8.28,21.67 8.4,21.55 U$5.1 | v14.81,21.97 14.81,20.54 U$6.2
  Top 0.406: v25.12,42.85 U6.2
  Route15 0.305: v7.62,37.81 8.17,37.26 20.75,37.26 25.09,32.92 25.09,31.55 JP1.8 | 10.17,19.77 v9.14,18.75 9.14,12.39 10.71,10.83 | 10.17,19.77 11.15,20.75 14.78,20.75 | 14.78,20.75 21.39,20.75 25.43,24.79 v25.43,27.17 | 10.71,10.83 6.1,6.22 3.58,6.22 v3.38,6.43 | v16.56,5.69 15.85,5.69 10.71,10.83 | v8.28,21.67 10.17,19.77 | v14.81,21.97 14.81,20.78 14.78,20.75
  Bottom 0.406: JP1.8 28.45,39.52 v25.12,42.85
-3V3  (via drill 0.35)
  Top 0.152: C25.1 27.37,48.09 | 27.37,48.09 28.3,49.02 U8.5 | U7.15 15.21,43.89 v15.9,43.89 | v28.57,47.65 27.81,47.65 27.37,48.09
  Bottom 0.152: v15.9,43.89 19.66,47.65 v28.57,47.65
ADC1  (via drill 0.35)
  Top 0.152: U4.6 20.81,34.69 20.81,34.23 21.13,33.91 v21.13,32.87 | C11.1 R24.1 4.18,47.75 4.27,47.75 | 4.27,47.75 R23.2 | v6.58,49.53 4.37,49.53 4.27,49.43 4.27,47.75
  Bottom 0.152: v21.13,32.87 20.85,33.15 20.85,33.63 19.96,34.52 16.66,34.52 8,43.18 8,48.11 v6.58,49.53
ADC2  (via drill 0.35)
  Top 0.152: U4.7 20.01,34.69 20.01,34.23 20.24,34 v20.24,33.38 | R21.2 6.48,47.75 | 6.48,47.75 R23.1 | 6.48,46.37 R22.1 5.71,46.51 v4.14,46.51 | 6.48,46.37 C10.1 | 6.48,46.37 6.48,47.75
  Bottom 0.152: v20.24,33.38 17.27,33.38 v4.14,46.51
BAL_OUT
  Top 0.152: T1.3 13.86,33.99 C26.1
CLK
  Top 0.152: U2.8 14.37,15.63 20.39,21.65 U4.19
CS
  Top 0.152: U4.18 19.59,24.09 19.73,23.95 19.73,21.52 14.34,16.13 U2.9
FILTER_IN
  Top 0.152: U5.3 10.02,47.75 R21.1
GND  (via drill 0.35)
  Top 0.152: R22.2 6.45,45.07 | 6.45,45.07 C10.2 | 13.93,17.45 U2.11 U2.10 12.19,16.63 U2.25 | 13.93,17.45 U2.12 | 10.78,36.91 U7.3 10.59,36.49 v10.59,35.61 | 10.78,36.91 10.78,37.78 10.88,37.88 10.88,37.97 10.52,38.33 | 12.01,37.87 12.08,37.81 U7.5 12.08,36.16 v12.39,35.84 | U7.8 13.13,37.42 12.78,37.77 12.78,38.02 U7.29 | U7.12 U7.11 U7.10 12.73,38.72 U7.29 | 13.14,40.02 U7.12 | U7.14 12.95,41.32 12.75,41.12 12.75,41.21 12.3,41.67 12.3,41.85 U7.17 | U5.2 10.79,48.39 8.89,50.29 X3.GND@1 | 6.45,45.07 6.33,45.2 R24.2 C11.2 1.78,45.37 1.1,46.05 1.1,46.94 5.34,51.18 X3.GND@1 | U3.17 5.33,10.04 U3.3 5.51,8.61 5.51,8.24 5.79,7.95 6.2,7.95 6.45,7.7 v6.55,7.7 7.08,7.7 C5.2 | U3.10 5.33,10.99 | 5.31,10.97 5.33,10.99 | U3.9 5.83,11.49 5.33,10.99 | U1.17 17.78,9.4 17.85,9.33 17.85,8.96 U1.3 18.03,8.41 18.34,8.1 18.44,8.1 18.82,7.72 v19.1,7.72 20.32,6.5 X2.GND@1 | U2.4 U2.5 U2.6 13.86,14.39 v13.92,14.45 | SW1.P$2 28.45,8.66 28.45,10.36 | 28.45,10.36 JP1.1 | 28.45,10.36 27.69,11.12 C6.2 21.69,11.8 20.62,11.8 20.61,11.79 U1.9 18.53,11.09 18.16,10.72 18.03,10.85 U1.10 18.03,12.53 v17.73,12.83 | T1.1 T1.2 11.18,33.08 v11.18,34.42 | U8.6 27.64,51.39 27.3,51.05 27.3,50.83 C25.2 24.38,46.89 v25.48,45.8 | 13.19,18.19 U2.13 13.43,18.62 v14.45,18.62 15.46,18.62 16.56,19.71 16.56,19.72 C15.2 | 13.19,18.19 13.19,17.73 12.59,17.13 U2.20 | v9.73,26.59 9.48,26.59 R13.2 | v9.7,25.43 9.38,25.43 R12.2 | v13.11,25.43 13.45,25.43 R11.1 16.5,24.38 C13.2 | v13.13,26.47 13.27,26.47 R14.1 16.97,27.69 U4.16 | U7.14 16.09,43.28 16.15,43.28 16.71,43.85 16.71,45.1 16.9,45.1 LED2.C LED1.C 20.73,45.93 C19.2 21.66,43.9 U6.3 21.66,42.04 v20.78,42.93
  Top 0.152: X3.GND@1 8.26,50.55 v7.57,50.55 | v7.59,51.84 7.62,51.84 8.28,51.18 X3.GND@1 | v15.42,51.46 14.25,51.46 X3.GND@2 14.88,50.27 v15.42,50.27 16.4,51.25 22.58,51.25 22.72,51.39 U8.3 | C14.2 28.97,40.65 v28.91,40.72 | v22.66,39.55 22.44,39.33 21.05,39.33 20.47,38.75 C18.2 | C22.1 5.66,36.87 v4.46,36.87 | 2.54,6.22 2.54,6.97 C12.1 | 2.54,6.22 v1.47,6.22 | X1.GND@1 7.62,5.59 v8.13,6.1 | X2.GND@2 15.24,6.06 C21.2 13.68,5.79 v13.16,5.79 | 10.78,36.91 10.27,37.42 U7.28 | C20.2 8.14,16.7 v7.39,17.45 6.82,18.02 C9.2 | U7.29 10.58,38.4 10.52,38.33 | U7.32 9.97,40.34 9.73,40.11 9.63,40.21 8.92,40.21 U7.24 U7.25 U7.26 10.04,38.72 11.15,39.83 11.15,40.36 12.39,40.36 U7.31 12.4,39.28 12.01,38.89 12.01,38.84 11.94,38.76 10.82,38.76 U7.30 10.52,38.33 | X1.GND@2 2.54,6.22 | U7.12 13.91,40.24 13.73,40.24 13.59,40.37 13.59,40.97 13.95,41.32 U7.14 | 13.93,17.45 13.19,18.19 | v27.1,36.07 26.56,36.07 R29.1 25.96,35.48 U4.32 | U2.25 11.94,16.05 10.83,14.94 10.83,14.53 U2.1 10.4,14.39 v9.96,13.95 | 12.19,14.4 12.19,15.09 | U2.25 11.94,15.34 12.19,15.09 | U2.25 12.19,16.13 12.19,15.09
  Top 0.305: U7.19 U7.20 U7.21 U7.22 8.3,41.32 v7.91,41.71 | U7.29 12.01,38 12.01,37.87 | U3.17 5.08,10.74 5.31,10.97 | U7.31 12.73,40.02 13.14,40.02 | U2.4 12.19,14.4 | R17.2 7.1,32.93 6.32,33.71 6.32,36.22 C22.1 | U2.5 12.69,15.63 U2.25 13.17,15.15 13.17,14.88 13.19,14.86 U2.6 | U7.31 12.08,40.67 U7.17 | U7.31 13.38,41.32 U7.14
  Route2 0.152: v9.75,21.54 9.78,21.57 v9.78,22.48 9.8,22.5 v9.8,23.42 9.8,25.32 v9.7,25.43 9.7,26.57 v9.73,26.59 11.33,28.19 v11.43,28.19 | v11.43,28.19 13.13,26.49 v13.13,26.47 13.13,25.45 v13.11,25.43 v13.11,23.37 13.11,22.48 v13.08,22.45 13.08,21.46 v13.11,21.44 13.11,19.96 v14.45,18.62 14.45,18.54 | v25.48,45.8 20.78,45.8 | 20.78,45.8 19.89,45.8 v15.42,50.27 | 23.32,40.21 v24.87,40.21 28.4,40.21 v28.91,40.72 28.91,37.87 v27.1,36.07 | 23.32,40.21 23.24,40.21 20.78,42.67 v20.78,42.93 20.78,45.8 | 23.32,40.21 v22.66,39.55 | v4.46,36.87 5.13,36.87 | 5.13,38.02 5.92,38.02 6.53,38.63 7.83,38.63 10.59,35.87 v10.59,35.61 11.18,35.03 v11.18,34.42 11.61,33.98 11.61,32.79 11.43,32.61 v11.43,28.19 | v1.47,6.22 2.95,7.7 v6.55,7.7 | v6.55,7.7 6.55,7.67 v8.13,6.1 8.43,5.79 v13.16,5.79 15.09,7.72 v19.1,7.72 | v6.55,7.7 10.16,11.3 | 10.16,11.3 10.93,12.07 11.63,12.07 13.29,13.72 13.29,14.68 13.6,15 | 14.45,18.54 14.45,15.84 13.6,15 | v6.04,13.16 6.63,12.57 v6.83,12.57 6.99,12.42 7.52,12.42 | 7.52,12.42 v7.75,12.42 | v7.75,12.42 7.72,12.45 v7.72,13.31 | v7.77,11.15 7.77,12.17 7.52,12.42 | v7.75,12.42 8.87,11.3 10.16,11.3 | v11.38,12.68 12.19,12.68 13.11,11.76 14.99,11.76 v15.32,12.09 15.95,12.09 v16.28,12.42 15.19,13.51 v15.19,13.66 15.21,13.69 | 15.21,13.69 15.27,13.74 v16.1,13.74 16.89,13.74 v17.07,13.56 17.73,12.9 v17.73,12.83 | v7.39,17.45 13.36,17.45 14.45,18.54 | 13.6,15 13.6,14.77 v13.92,14.45 14.45,14.45 15.21,13.69
  Route2 0.305: v7.91,41.71 5.13,38.93 5.13,38.02 5.13,36.87
  Bottom 0.152: 14.25,51.46 7.98,51.46 v7.59,51.84 8.23,51.84 X3.GND@1 | v15.42,50.27 7.85,50.27 v7.57,50.55 | X1.GND@1 7.62,5.59 v8.13,6.1 | X2.GND@2 15.24,3.71 v13.16,5.79 | v19.1,7.72 19.1,4.52 X2.GND@1 | X3.GND@2 14.25,51.46 | 14.25,51.46 v15.42,51.46 | X1.GND@2 1.47,4.37 v1.47,6.22
  pour Route2: 0.03,54.25 0.03,0.03 30.43,0.03 30.43,54.25
  pour Top: 0.03,54.25 0.03,0.03 30.43,0.03 30.43,54.25
  pour Bottom: 0.03,54.25 0.03,0.03 30.45,0.03 30.45,54.25
  pour Route15: 0.03,54.28 0.03,0.03 30.45,0.03 30.45,54.25 0.05,54.25
N$1
  Top 0.152: C1.2 6.7,11.8 6.02,12.47 5.14,12.47 5.01,12.34 5.01,11.97 U3.11
N$2
  Top 0.152: C1.1 10.73,13.1 11.19,13.55 U2.2
N$3
  Top 0.152: C2.2 12.05,13.1 11.69,13.46 U2.3
N$4
  Top 0.152: U1.11 17.53,12.16 16.61,13.08 15.38,13.08 C2.1
N$5
  Top 0.152: C3.2 5.08,7.82 4.83,8.08 U3.2
N$6
  Top 0.152: X2.P C4.1
N$7
  Top 0.152: C4.2 17.78,7.9 17.53,8.15 U1.2
N$8
  Top 0.152: X1.P C3.1
N$9
  Top 0.152: U2.17 11.19,20.17 | 11.19,20.17 11.19,21.69 C7.2 | U$5.2 11.16,20.19 11.19,20.17
N$10
  Top 0.152: U2.16 11.69,20.17 | 11.69,20.17 11.69,21.71 C8.2 | U$6.1 12.44,20.17 11.69,20.17
N$11
  Top 0.152: C8.1 12.06,24.41 | 12.06,24.41 R15.2 | R11.2 12.09,24.38 12.06,24.41
N$12
  Top 0.152: C5.1 6.71,10.16 U3.6 | U3.6 U3.7 U3.8 | U3.6 U3.5 U3.4
N$13
  Top 0.152: C6.1 19.37,11.12 U1.8 U1.7 U1.6 U1.5 U1.4
N$14  (via drill 0.35)
  Top 0.152: v12.5,10.46 14.83,10.46 16.16,11.79 U1.12 | R10.1 20.83,14.44 v20.83,13.69
  Bottom 0.152: v20.83,13.69 20.83,12.29 18.95,10.41 12.55,10.41 v12.5,10.46
N$15  (via drill 0.35)
  Top 0.152: U1.13 16.1,10.86 15.73,10.86 14.47,9.6 v12.98,9.6 | R9.1 19.74,14.23 v19.74,13.69
  Bottom 0.152: v12.98,9.6 12.72,9.86 12.24,9.86 11.82,10.29 11.76,10.29 11.76,10.85 12.02,10.85 12.24,11.07 19.18,11.07 19.27,11.16 19.13,11.3 19.13,13.08 v19.74,13.69
N$16  (via drill 0.35)
  Top 0.152: U1.14 16.1,10.36 15.73,10.36 14.31,8.94 12.58,8.94 12.32,8.69 v11.86,8.69 | R8.1 22.02,14.54 v22.02,13.69
  Bottom 0.152: v11.86,8.69 12.17,8.99 13.23,8.99 13.53,9.3 18.31,9.3 22.02,13.01 v22.02,13.69
N$17  (via drill 0.35)
  Top 0.152: U1.15 16.1,9.86 15.73,9.86 14.1,8.23 13.01,8.23 12.48,7.7 v11.91,7.7 | R7.1 v23.22,13.66
  Bottom 0.152: v11.91,7.7 12.85,8.64 19.48,8.64 23.22,12.37 v23.22,13.66
N$18  (via drill 0.35)
  Top 0.152: U1.16 14.66,7.92 13.56,7.92 v12.9,7.26 | R6.1 18.49,14.21 v18.49,13.69
  Bottom 0.152: v12.9,7.26 12.34,7.26 12.16,7.09 11.66,7.09 11.31,7.45 11.31,7.9 11,8.2 11,10.59 12.85,12.45 15.65,15.24 16.94,15.24 v18.49,13.69
N$19
  Top 0.152: U3.12 4.33,12.32 R5.1
N$20
  Top 0.152: U3.13 3.58,12.83 R4.1
N$21
  Top 0.152: U3.14 3.14,10.54 2.51,11.17 2.51,13.03 R3.1
N$22
  Top 0.152: U3.15 3.55,10.06 3.18,10.06 1.88,11.36 1.88,13.68 R2.1
N$23
  Top 0.152: U3.16 3.4,9.71 3.03,9.71 1.52,11.22 R1.1
N$24
  Top 0.152: C7.1 10.79,24.43 | 10.79,24.43 R16.2 | R12.1 10.77,24.41 10.79,24.43
N$25
  Top 0.152: R15.1 12.06,27.69 12.7,27.69 | 12.7,27.69 R14.2 | T1.4 12.7,27.69
N$26
  Top 0.152: R16.1 10.79,27.71 10.16,27.71 | T1.6 10.16,27.71 | R13.1 10.16,27.71
N$27
  Top 0.152: C26.2 12.41,34.77 11.43,35.75 U7.4
N$28
  Top 0.152: C23.1 11.43,43.7 U7.18
N$29  (via drill 0.35)
  Top 0.305: U8.7 28.17,51.91 27.41,51.91 26.91,51.41 v25.96,51.41 | v28.47,43.97 28.02,44.42 N$29.2
  Route15 0.305: v28.47,43.97 25.96,46.48 v25.96,51.41
N$30  (via drill 0.35)
  other vias: 14.17,33.27
N$31
  Top 0.305: U8.2 21.37,52.04 C24.1
N$32
  Top 0.152: U5.1 11.45,51.17 X3.P
N$33  (via drill 0.35)
  Top 0.152: U4.2 23.59,33.7 v23.39,33.5 | v18.8,39.47 18.8,40.62 R25.1
  Bottom 0.152: v23.39,33.5 23.39,34.87 v18.8,39.47
N$34  (via drill 0.35)
  Top 0.152: U4.3 22.79,34.09 v22.23,33.53 | v17.6,39.5 17.6,41.01 R26.1
  Bottom 0.152: v22.23,33.53 22.23,34.87 v17.6,39.5
N$35
  Top 0.152: R25.2 LED1.A
N$36
  Top 0.152: R26.2 LED2.A
N$37
  Top 0.305: U8.4 22.4,50.74 C24.2
N$38
  Top 0.152: R29.2 26.04,37.8 | 26.04,37.8 R28.2 | U4.31 25.55,33.15 25.09,33.15 24.96,33.29 24.96,36.72 26.04,37.8
N$39
  Top 0.305: T1.5 11.43,31.09 11.4,31.11 8.45,31.11 R17.1
N$44
  Top 0.152: U7.27 8.52,38.29 8.34,38.29 8.2,38.42 8.2,40.32 8.34,40.45 8.52,40.45 U7.23
N$45
  Top 0.152: U7.9 14.34,38.29 14.53,38.29 14.66,38.42 14.66,40.32 14.53,40.45 14.34,40.45 U7.13
N$46
  Top 0.152: 10.13,36.58 U7.2
  Top 0.305: R30.1 8.27,34.52 10.13,36.38 10.13,36.58
NRST  (via drill 0.35)
  Top 0.152: U4.4 21.99,36.73 22.27,37.01 22.27,37.62 | R27.2 22.27,38.07 22.27,37.62 | 22.27,37.62 22.34,37.54 v23.01,37.54
  Top 0.305: SW1.P$1 27.26,1.57 v24.84,1.57
  Bottom 0.152: v23.01,37.54 27.33,33.22 27.33,27.73 27.43,27.63 27.43,26.22 27.33,26.12 27.33,22.65 28.45,21.53 JP1.5 24.84,16.97 v24.84,1.57
SDIO  (via drill 0.35)
  Top 0.152: v21.29,24.23 21.29,24.97 21.19,25.06 U4.20 | U2.7 14.08,15.28 14.48,15.28 15.26,16.05 v15.85,16.05
  Bottom 0.152: v15.85,16.05 15.85,18.8 v21.29,24.23
SV1  (via drill 0.35)
  Top 0.152: U5.4 9.76,44.95 v9.43,44.95 | U4.15 17.63,28.32 18.09,28.32 18.41,27.99 v18.85,27.99
  Bottom 0.152: v18.85,27.99 18.85,28.55 20.24,29.95 20.24,31.12 21.74,32.62 21.74,33.12 21.16,33.7 21.16,33.75 20.09,34.82 17.48,34.82 9.43,42.87 v9.43,44.95
SV2  (via drill 0.35)
  Top 0.152: U5.6 12.42,45.34 v12.72,45.03 | U4.25 26.7,27.2 v26.82,27.2
  Bottom 0.152: v12.72,45.03 17.66,40.1 19.02,40.1 26.82,32.3 v26.82,27.2
SW_IN
  Top 0.152: C23.2 10.79,44.69 U5.5
SWCLK
  Top 0.152: JP1.4 24.39,22.09 U4.24
SWDIO
  Top 0.152: U4.23 23.59,20.35 JP1.3
UART_RX
  Top 0.152: JP1.6 24.77,26.79 24.77,27.57 18.81,33.53 U4.9
UART_TX  (via drill 0.35)
  Top 0.152: v18.52,36.58 18.79,36.3 U4.8
  Route15 0.152: v18.52,36.58 21.62,33.47 21.62,33.28 23.8,31.09 23.8,28.98 24.26,28.53 26.36,28.53 28.45,26.44 JP1.7
V1L  (via drill 0.35)
  Top 0.152: U4.28 25.09,30.33 v24.41,31.01 | v20.7,16.82 20.68,16.79 R10.2
  Bottom 0.152: v24.41,31.01 23.65,31.01 23.34,30.71 23.34,19.46 v20.7,16.82
V1R  (via drill 0.35)
  Top 0.152: U4.14 18.71,29.53 v18.77,29.59 | v6.48,17.22 6.48,16.02 R5.2
  Bottom 0.152: v6.48,17.22 6.48,29.59 v18.77,29.59
V2L  (via drill 0.35)
  Top 0.152: v24.31,31.93 24.61,31.62 24.66,31.62 25.15,31.13 U4.29 | v19.41,16.87 19.38,16.84 R9.2
  Bottom 0.152: v24.31,31.93 22.96,31.93 22.48,31.45 22.48,19.94 v19.41,16.87
V2R  (via drill 0.35)
  Top 0.152: U4.13 18.39,30.33 18.42,30.3 19.53,30.3 v19.63,30.2 | v5.36,17.22 5.36,15.91 R4.2
  Bottom 0.152: v19.63,30.2 5.36,30.2 v5.36,17.22
V3L  (via drill 0.35)
  Top 0.152: U4.27 25.02,29.53 v24.46,30.1 | v21.97,16.82 R8.2
  Bottom 0.152: v24.46,30.1 24.46,29.94 23.9,29.39 23.9,18.75 v21.97,16.82
V3R  (via drill 0.35)
  Top 0.152: U4.12 18.45,31.13 v18.67,30.91 | v4.09,17.22 4.09,15.91 R3.2
  Bottom 0.152: v18.67,30.91 18.26,30.5 4.09,30.5 v4.09,17.22
V4L  (via drill 0.35)
  Top 0.152: U4.26 24.91,28.73 v24.51,29.13 | v23.22,16.82 R7.2
  Bottom 0.152: v23.22,16.82 23.22,17.09 24.51,18.39 v24.51,29.13
V4R  (via drill 0.35)
  Top 0.152: U4.11 18.26,31.93 18.44,31.75 19.28,31.75 v19.43,31.6 | v2.79,17.22 R2.2
  Bottom 0.152: v19.43,31.6 19.35,31.52 2.79,31.52 v2.79,17.22
V5L  (via drill 0.35)
  Top 0.152: v24.18,32.87 24.51,32.53 24.56,32.53 25.16,31.93 U4.30 | v18.14,16.92 18.11,16.89 R6.2
  Bottom 0.152: v24.18,32.87 23.16,32.87 21.89,31.59 21.89,20.67 v18.14,16.92
V5R  (via drill 0.35)
  Top 0.152: U4.10 18.32,32.73 v18.69,32.36 | v1.55,17.22 1.55,15.91 R1.2
  Bottom 0.152: v18.69,32.36 18.16,31.82 1.55,31.82 v1.55,17.22
VA
  Top 0.152: U4.21 21.57,26.78 21.57,27.23 19.82,28.98 18.52,28.98 18.35,29.15 16.34,29.15 16.2,29.29 16.2,32.51 15.73,32.99 15.73,35.36 15.62,35.46 13.25,35.46 13.07,35.64 13.07,36.15 12.95,36.27 12.95,36.46 U7.6
VB
  Top 0.152: U4.22 22.37,26.78 22.37,29.54 18.8,33.12 16.03,33.12 16.03,35.69 15.95,35.77 13.38,35.77 U7.7

### Text on the board
tPlace: OUT | 10uF | 5Ω | 5Ω | 10nF | 45Ω | READY | WAIT | 10uF | 100uF | 100nF | 10nF | 45Ω | 100nF | 10uF | 100uF | 10kΩ | 10kΩ | 100nF | 100nF | 100nF | 560Ω | 5-GND | 5V | TX | 100nF | 100nF | 100nF | RX | NRST | 100Ω | 100nF | 100Ω | SWCLK | DIO | 3V3 | 100nF | 330pF | GND | 100nF | 330pF | 100nF | 100nF | 100nF | RESET | IN1 | IN2